# Altium schematic sheet MCU.SchDoc
size A3; SheetNumber: 4; SheetTotal: 5
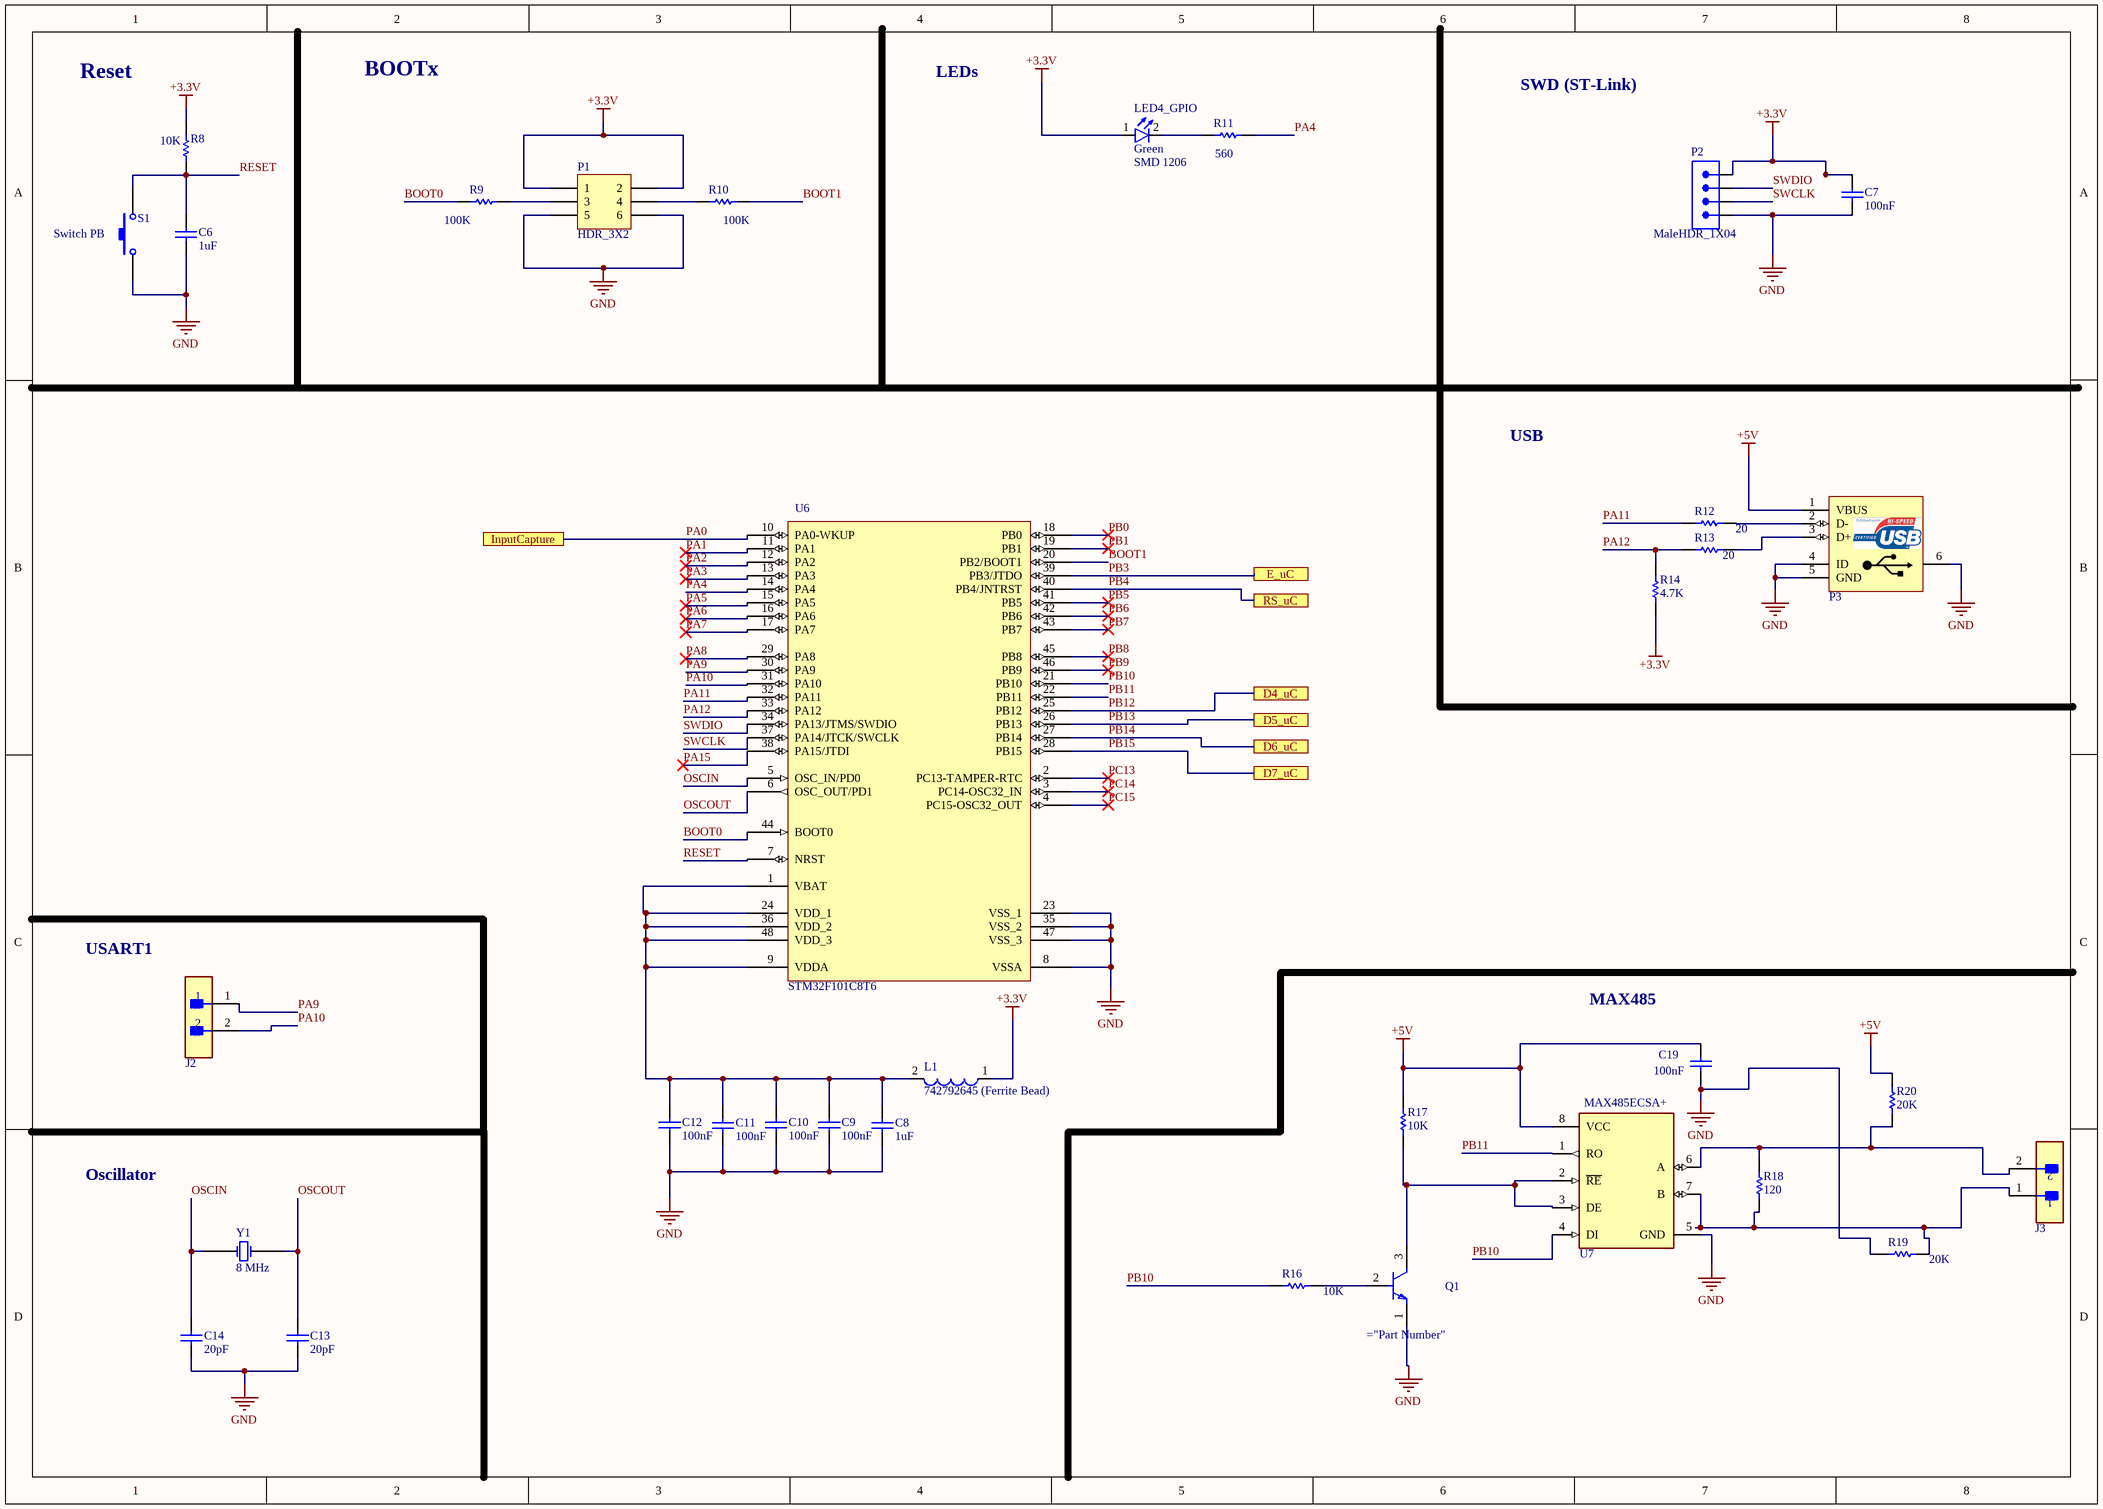
[diagram p0: MCU.SchDoc]

## Parts
C6  1uF  [CAPC3216L (1206)]
C7  100nF  [CAPC3216L (1206)]
C8  1uF  [Cap - 100nF]
C9  100nF  [CAPC3216M (1206)]
C10  100nF  [CAPC3216M (1206)]
C11  100nF  [CAPC3216M (1206)]
C12  100nF  [CAPC3216M (1206)]
C13  20pF  [CAPC1608M (0603)]
C14  20pF  [CAPC1608M (0603)]
C19  100nF  [CAPC3216M (1206)]
J2  B2B-XH-A_LF_SN  [JST_0_MFG]  (value not drawn)
J3  B2B-XH-A_LF_SN  [JST_0_MFG]  (value not drawn)
L1  742792645 (Ferrite Bead)  [SMD-0603]
LED4_GPIO  Size: SMD 1206  [LED SMD 1206]  (hidden comment: Green)
P1  HDR_3X2  [MISC_HDR_2X3]
P2  MaleHDR_1X04  [MHDR1X04-254P]
P3  USB Connector  [USB_AB_BM_SHS]  (value not drawn)
Q1  2N3904TF  [ON_Semiconductor_135AR_MFG]  (value not drawn)
R8  10K  [RESC3216X60L (1206)]
R9  100K  [RESC3216X60M (1206)]
R10  100K  [RESC3216X60M (1206)]
R11  560  [RESC3216X60M (1206)]
R12  20  [RESC3216X60M (1206)]
R13  20  [RESC3216X60M (1206)]
R14  4.7K  [RESC3216X60M (1206)]
R16  10K  [RESC3216X60M (1206)]
R17  10K  [RESC3216X60M (1206)]
R18  120  [RESC3216X60M (1206)]
R19  20K  [RESC3216X60M (1206)]
R20  20K  [RESC3216X60M (1206)]
S1  Switch PB  [Switch - Push to On]
U6  STM32F101C8T6  [LQFP48_L]
U7  MAX485ECSA+  [Maxim_Integrated_S8-5_MFG]
Y1  8 MHz  [Crystal SMD]

## Ports
D4_uC, D5_uC, D6_uC, D7_uC, E_uC, InputCapture, RS_uC

## Nets
+3.3V: C7.1(+) L1.1 LED4_GPIO.1(A) P1.1 P1.2 P2.4 R8.2 R14.1
+5V: C19.2(-) P3.1(VBUS) R17.2 R20.2 U7.8(VCC)
GND: C6.2(-) C7.2(-) C8.2(-) C9.2(-) C10.2(-) C11.2(-) C12.2(-) C13.2(-) C14.2(-) C19.1(+) P1.5 P1.6 P2.1 P3.4(ID) P3.5(GND) P3.6(MH) Q1.1(E) R19.1 S1.1 U6.8(VSSA) U6.23(VSS_1) U6.35(VSS_2) U6.47(VSS_3) U7.5(GND)
BOOT0: R9.1 U6.44(BOOT0)
BOOT1: R10.2 U6.20(PB2/BOOT1)
OSCIN: C14.1(+) U6.5(OSC_IN/PD0) Y1.1(OSC1)
OSCOUT: C13.1(+) U6.6(OSC_OUT/PD1) Y1.2(OSC2)
PA0: U6.10(PA0-WKUP) ; port InputCapture
PA1: U6.11(PA1)
PA2: U6.12(PA2)
PA3: U6.13(PA3)
PA4: R11.2 U6.14(PA4)
PA5: U6.15(PA5)
PA6: U6.16(PA6)
PA7: U6.17(PA7)
PA8: U6.29(PA8)
PA9: J2.1 U6.30(PA9)
PA10: J2.2 U6.31(PA10)
PA11: R12.1 U6.32(PA11)
PA12: R13.1 R14.2 U6.33(PA12)
PA15: U6.38(PA15/JTDI)
PB0: U6.18(PB0)
PB1: U6.19(PB1)
PB3: U6.39(PB3/JTDO) ; port E_uC
PB4: U6.40(PB4/JNTRST) ; port RS_uC
PB5: U6.41(PB5)
PB6: U6.42(PB6)
PB7: U6.43(PB7)
PB8: U6.45(PB8)
PB9: U6.46(PB9)
PB10: R16.1 U6.21(PB10) U7.4(DI)
PB11: U6.22(PB11) U7.1(RO)
PB12: U6.25(PB12) ; port D4_uC
PB13: U6.26(PB13) ; port D5_uC
PB14: U6.27(PB14) ; port D6_uC
PB15: U6.28(PB15) ; port D7_uC
PC13: U6.2(PC13-TAMPER-RTC)
PC14: U6.3(PC14-OSC32_IN)
PC15: U6.4(PC15-OSC32_OUT)
RESET: C6.1(+) R8.1 S1.2 U6.7(NRST)
SWCLK: P2.2 U6.37(PA14/JTCK/SWCLK)
SWDIO: P2.3 U6.34(PA13/JTMS/SWDIO)
NetC8_1: C8.1(+) C9.1(+) C10.1(+) C11.1(+) C12.1(+) L1.2 U6.1(VBAT) U6.9(VDDA) U6.24(VDD_1) U6.36(VDD_2) U6.48(VDD_3)
NetJ3_1: J3.1 R18.1 R19.2 U7.7(B)
NetJ3_2: J3.2 R18.2 R20.1 U7.6(A)
NetLED4_GPIO_2: LED4_GPIO.2(K) R11.1
NetP1_3: P1.3 R9.2
NetP1_4: P1.4 R10.1
NetP3_2: P3.2(D-) R12.2
NetP3_3: P3.3(D+) R13.2
NetQ1_2: Q1.2(B) R16.2
NetQ1_3: Q1.3(C) R17.1 U7.2(~{RE}) U7.3(DE)

## Notes on the sheet
- Reset
- BOOTx
- LEDs
- SWD (ST-Link)
- USB
- USART1
- MAX485
- Oscillator
- (in symbol USB AB MICRO CONNECTOR) D:AbbasBasereh

## Library data of the parts
C6-C14 C19 = CAP_Bipolar: Bipolar Capacitor; Voltage: 100V; Designer: Eng. Saeid Jorablo; Company: SJ Libraries; ComponentLink1Description: Datasheet; ComponentLink2Description: Reference; Publisher: SJ Unlimited; Mounting Technology: *; Mounting Technology: Surface Mount\Through-Hole; HelpURL: http://s3.picofile.com/file/7443264187/Coming_Soon_logo.gif; Status: Unreleased
  C6 C8: Value: 1uF
  C7 C9-C12 C19: Value: 100nF
  C13 C14: Value: 20pF
L1 = 742792645: SMD EMI Suppression Ferrite Bead WE-CBF, Z = 470 Ohm; Impedance: 470 Ohm; DatasheetVersion: ver 1, Aug-2009; PackageVersion: 2009; PackageReference: SMD-0603; PackageDescription: Chip Inductor, 2-Leads, Body 1.6 x 0.8 mm; ComponentLink1Description: Manufacturer URL; ComponentLink1URL: http://www.we-online.com; ComponentLink2Description: Datasheet; ComponentLink2URL: http://www.we-online.de/katalog/media/pdf/742792645.pdf
LED4_GPIO = LED: Designer: Saeid Jorablo; Organazation: ControTec; Adding Date: 1387/12/22; Color: Green
P1 = HDR_3X2: Header, 3-Pin, Dual row; designer: Eng. Saeid Jorablo; Company: SJ Libraries; Max Current: mA; LatestRevisionDate: 17-Jul-2002; Publisher: SJ UnLimited; Mounting Technology: Through-Hole; Category: Headers; Pin Count: 6; Status: Unreleased; ComponentLink1Description: Datasheet; ComponentLink2Description: Reference; Update: 7/8/2012; HelpURL: http://s3.picofile.com/file/7443264187/Coming_Soon_logo.gif
P2 = MHDR_1X04: Male Header 1X04
P3 = USB AB MICRO CONNECTOR: USB MICRO-B Type Connector; Designer: ABBAS BASEREH; Max Current: 1600mA; Mounting Technology: Surface Mount\Through-Hole; Category: Connector; Pin Count: 5-7; Publisher: ABBAS BASEREH; Status: Unreleased; ComponentLink1Description: Datasheet; ComponentLink2Description: Reference; Update: 1395-11-17
R8-R14 R16-R20 = RES: Resistor; Designer: Eng. Saeid Jorablo; Company: SJ Libraries; Tolerance: 5%; Power: 1/8 W; Value: 1K; Category: Resistors; ComponentLink1Description: Datasheet; ComponentLink2Description: Reference; PackageDescription: SMD & TH Resistors; Publisher: SJ Unlimited; Mounting Technology: Surface Mount\Through-Hole; HelpURL: http://s3.picofile.com/file/7443264187/Coming_Soon_logo.gif; Status: Unreleased
S1 = Switch PB: Push Button Switch
U6 = STM32F101C8T6: STM32 ARM-based 32-bit MCU with 64 Kbytes Flash, 48-pin LQFP, Industrial Temperature; Published: 30-May-2008; DatasheetVersion: rev6, Mar-2008; PackageVersion: Mar-2008; PackageReference: LQFP48; Publisher: Altium Limited; PackageDescription: 48-Pin Low-Profile Quad Flat Pack, 7 x 7 mm Body, 0.5 mm Pitch (LQFP48); ComponentLink1Description: Manufacturer Link; ComponentLink1URL: www.st.com/stm32; ComponentLink2Description: Datasheet; ComponentLink2URL: http://www.st.com/stonline/products/literature/ds/13586.pdf
Y1 = XTAL_Crystal: XTAL Crystal; Designer: ABBAS BASEREH; Value: 12 MHz; Design Date: 2017-1-3; ComponentLink1Description: Datasheet; ComponentLink2Description: Reference; Mounting Technology: Surface Mount\Through-Hole; Status: Unreleased